# Altium schematic sheet SAMC21N_Xplained_Pro_Target_MCU.SchDoc: Target MCU
size A3; Organization: Microchip India; DocumentNumber: A09-2682; Revision: 4; SheetNumber: 4; SheetTotal: 9; CheckedBy: M.S.K; DrawnBy: Microchip India; PageSetup: Record=PageOptions|CenterHorizontal=True|CenterVertical=True|PrintScale=1.04|XCorrection=1.00|YCorrection=1.00|PrintKind=0|BorderSize=5000000|LeftOffset=0|BottomOffset=0|Orientation=2|PaperLength=4200|PaperWidth=2970|Scale=100|PaperSource=15|PrintQuality=600|MediaType=1|DitherType=10|PrintScaleMode=1|PaperKind=A3|PaperIndex=8; ProjectTitle: ATSAMC21N-XPRO; PCBNumber: A08-2581; PCBRevision: 2
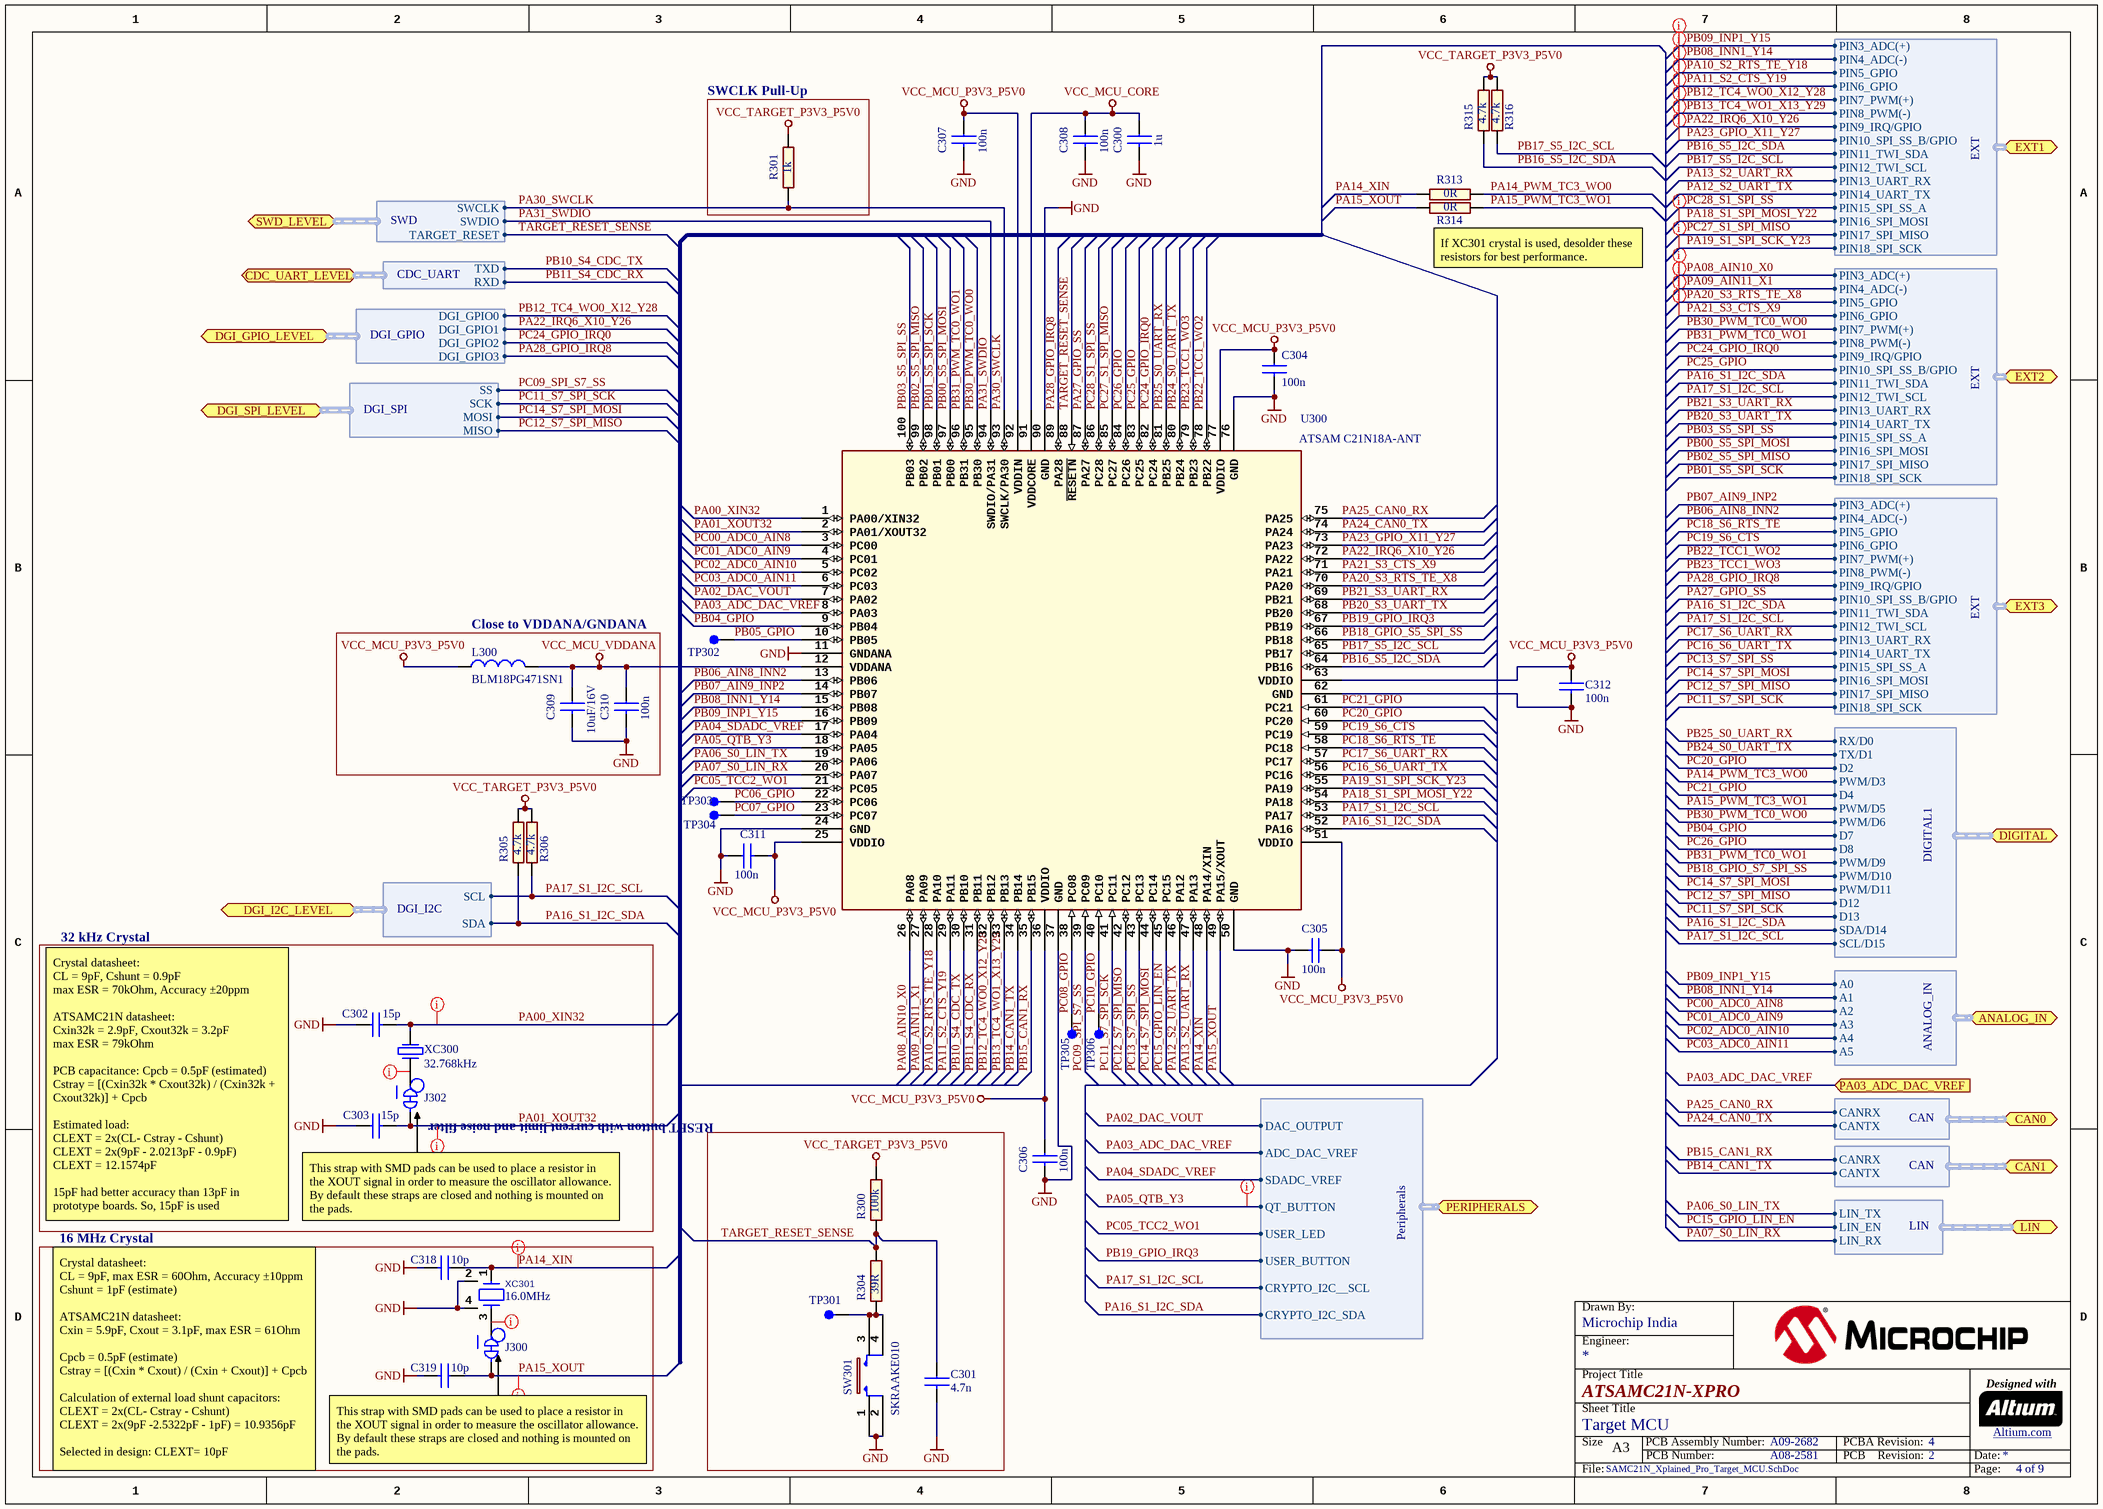
[diagram p0: SAMC21N_Xplained_Pro_Target_MCU.SchDoc]

## Parts
C300  value 1u  [AP1-00001]  (hidden comment: CAP-NONPOL)
C301  value 4.7n  [AP1-00001]  (hidden comment: CAP-NONPOL)
C302  value 15p  [AP1-00001]  (hidden comment: CAP-NONPOL)
C303  value 15p  [AP1-00001]  (hidden comment: CAP-NONPOL)
C304  value 100n  [AP1-00001]  (hidden comment: CAP-NONPOL)
C305  value 100n  [AP1-00001]  (hidden comment: CAP-NONPOL)
C306  value 100n  [AP1-00001]  (hidden comment: CAP-NONPOL)
C307  value 100n  [AP1-00001]  (hidden comment: CAP-NONPOL)
C308  value 100n  [AP1-00001]  (hidden comment: CAP-NONPOL)
C309  value 10uF/16V  [AP1-00039]  (hidden comment: CAP-NONPOL)
C310  value 100n  [AP1-00001]  (hidden comment: CAP-NONPOL)
C311  value 100n  [AP1-00001]  (hidden comment: CAP-NONPOL)
C312  value 100n  [AP1-00001]  (hidden comment: CAP-NONPOL)
C318  value 10p  [AP1-00001]  (hidden comment: CAP-NONPOL)
C319  value 10p  [AP1-00001]  (hidden comment: CAP-NONPOL)
J300  (no value)  [AP9-00044]  (net tie, no BOM)
J302  (no value)  [AP9-00044]  (net tie, no BOM)
L300  BLM18PG471SN1  [AP3-00005]
R300  value 100k  [AP2-00011]  (hidden comment: R2)
R301  value 1k  [AP2-00000]  (hidden comment: R2)
R304  value 39R  [AP2-00011]  (hidden comment: R2)
R305  value 4.7k  [AP2-00000]  (hidden comment: R2)
R306  value 4.7k  [AP2-00000]  (hidden comment: R2)
R313  value 0R  [AP2-00000]  (hidden comment: R2)
R314  value 0R  [AP2-00000]  (hidden comment: R2)
R315  value 4.7k  [AP2-00000]  (hidden comment: R2)
R316  value 4.7k  [AP2-00000]  (hidden comment: R2)
SW301  value SKRAAKE010  [AP8-00137]  (hidden comment: Can be ordered in low volumes from Mouser)
TP301  TESTPOINT  [AP8-00010]  (value not drawn)  (no BOM)
TP302  TESTPOINT  [AP8-00256]  (value not drawn)  (no BOM)
TP303  TESTPOINT  [AP8-00256]  (value not drawn)  (no BOM)
TP304  TESTPOINT  [AP8-00256]  (value not drawn)  (no BOM)
TP305  TESTPOINT  [AP8-00256]  (value not drawn)  (no BOM)
TP306  TESTPOINT  [AP8-00256]  (value not drawn)  (no BOM)
U300  value ATSAM C21N18A-ANT  [AP6-00008]  (hidden comment: SAMC21N_TQFP100)
XC300  value 32.768kHz  [AP7-00090]  (hidden comment: CRYSTAL)
XC301  value 16.0MHz  [AP7-00061]  (hidden comment: TSX-3225)

## Blocks framed on the sheet
SWCLK Pull-Up: R301
Close to VDDANA/GNDANA: C309 C310 L300
32 kHz Crystal: C302 C303 J302 XC300
RESET button with current limit and noise filter: C301 R300 R304 SW301 TP301
16 MHz Crystal: C318 C319 J300 XC301

## Ports
ANALOG_IN (harness ANALOG_IN), CAN0 (harness CAN), CAN1 (harness CAN), CDC_UART_LEVEL (harness CDC_UART), DGI_GPIO_LEVEL (harness DGI_GPIO), DGI_I2C_LEVEL (harness DGI_I2C), DGI_SPI_LEVEL (harness DGI_SPI), DIGITAL (harness DIGITAL1), EXT1 (harness EXT), EXT2 (harness EXT), EXT3 (harness EXT), LIN (harness LIN), PA03_ADC_DAC_VREF (in), PERIPHERALS (harness Peripherals), SWD_LEVEL (harness SWD)

## Harnesses
SWD: SWCLK, SWDIO, TARGET_RESET
DGI_GPIO: DGI_GPIO0, DGI_GPIO1, DGI_GPIO2, DGI_GPIO3
DGI_SPI: MISO, MOSI, SCK, SS
DGI_I2C: SCL, SDA
CDC_UART: RXD, TXD
EXT: PIN10_SPI_SS_B/GPIO, PIN11_TWI_SDA, PIN12_TWI_SCL, PIN13_UART_RX, PIN14_UART_TX, PIN15_SPI_SS_A, PIN16_SPI_MOSI, PIN17_SPI_MISO, PIN18_SPI_SCK, PIN3_ADC(+), PIN4_ADC(-), PIN5_GPIO, PIN6_GPIO, PIN7_PWM(+), PIN8_PWM(-), PIN9_IRQ/GPIO
DIGITAL1: RX/D0, TX/D1, D2, PWM/D3, D4, PWM/D5, PWM/D6, D7, D8, PWM/D9, PWM/D10, PWM/D11, D12, D13, SDA/D14, SCL/D15
ANALOG_IN: A0, A1, A2, A3, A4, A5
CAN: CANTX, CANRX
LIN: LIN_RX, LIN_EN, LIN_TX
Peripherals: DAC_OUTPUT, ADC_DAC_VREF, SDADC_VREF, QT_BUTTON, USER_LED, USER_BUTTON, CRYPTO_I2C__SCL, CRYPTO_I2C_SDA

## Nets
GND: C300.2 C301.2 C302.1 C303.1 C304.2 C305.2 C306.2 C307.2 C308.2 C309.2 C310.2 C311.1 C312.2 C318.2 C319.2 SW301.1 SW301.2 U300.11(GNDANA) U300.24(GND) U300.37(GND) U300.50(GND) U300.62(GND) U300.76(GND) U300.90(GND) XC301.2(GND) XC301.4(GND)
VCC_MCU_CORE: C300.1 C308.1 U300.91(VDDCORE)
VCC_MCU_P3V3_P5V0: C304.1 C305.1 C306.1 C307.1 C311.2 C312.1 L300.1 U300.25(VDDIO) U300.36(VDDIO) U300.51(VDDIO) U300.63(VDDIO) U300.77(VDDIO) U300.92(VDDIN)
VCC_MCU_VDDANA: C309.1 C310.1 L300.2 U300.12(VDDANA)
VCC_TARGET_P3V3_P5V0: R300.2 R301.2 R305.2 R306.2 R315.2 R316.2
PA00_XIN32: C302.2 U300.1(PA00/XIN32) XC300.1
PA01_XOUT32: C303.2 J302.2 U300.2(PA01/XOUT32)
PA02_DAC_VOUT: U300.7(PA02) ; port PERIPHERALS.DAC_OUTPUT
PA03_ADC_DAC_VREF: U300.8(PA03) ; port PA03_ADC_DAC_VREF, port PERIPHERALS.ADC_DAC_VREF
PA04_SDADC_VREF: U300.17(PA04) ; port PERIPHERALS.SDADC_VREF
PA05_QTB_Y3: U300.18(PA05) ; port PERIPHERALS.QT_BUTTON
PA06_S0_LIN_TX: U300.19(PA06) ; port LIN.LIN_TX
PA07_S0_LIN_RX: U300.20(PA07) ; port LIN.LIN_RX
PA08_AIN10_X0: U300.26(PA08) ; port EXT2.PIN3_ADC(+)
PA09_AIN11_X1: U300.27(PA09) ; port EXT2.PIN4_ADC(-)
PA10_S2_RTS_TE_Y18: U300.28(PA10) ; port EXT1.PIN5_GPIO
PA11_S2_CTS_Y19: U300.29(PA11) ; port EXT1.PIN6_GPIO
PA12_S2_UART_TX: U300.46(PA12) ; port EXT1.PIN14_UART_TX
PA13_S2_UART_RX: U300.47(PA13) ; port EXT1.PIN13_UART_RX
PA14_PWM_TC3_WO0: R313.2 ; port DIGITAL.PWM/D3
PA14_XIN: C318.1 R313.1 U300.48(PA14/XIN) XC301.1(IN)
PA15_PWM_TC3_WO1: R314.2 ; port DIGITAL.PWM/D5
PA15_XOUT: C319.1 J300.2 R314.1 U300.49(PA15/XOUT)
PA16_S1_I2C_SDA: R305.1 U300.52(PA16) ; port DGI_I2C_LEVEL.SDA, port EXT2.PIN11_TWI_SDA, port EXT3.PIN11_TWI_SDA, port DIGITAL.SDA/D14, port PERIPHERALS.CRYPTO_I2C_SDA
PA17_S1_I2C_SCL: R306.1 U300.53(PA17) ; port DGI_I2C_LEVEL.SCL, port EXT2.PIN12_TWI_SCL, port EXT3.PIN12_TWI_SCL, port DIGITAL.SCL/D15, port PERIPHERALS.CRYPTO_I2C__SCL
PA18_S1_SPI_MOSI_Y22: U300.54(PA18) ; port EXT1.PIN16_SPI_MOSI
PA19_S1_SPI_SCK_Y23: U300.55(PA19) ; port EXT1.PIN18_SPI_SCK
PA20_S3_RTS_TE_X8: U300.70(PA20) ; port EXT2.PIN5_GPIO
PA21_S3_CTS_X9: U300.71(PA21) ; port EXT2.PIN6_GPIO
PA22_IRQ6_X10_Y26: U300.72(PA22) ; port DGI_GPIO_LEVEL.DGI_GPIO1, port EXT1.PIN9_IRQ/GPIO
PA23_GPIO_X11_Y27: U300.73(PA23) ; port EXT1.PIN10_SPI_SS_B/GPIO
PA24_CAN0_TX: U300.74(PA24) ; port CAN0.CANTX
PA25_CAN0_RX: U300.75(PA25) ; port CAN0.CANRX
PA27_GPIO_SS: U300.87(PA27) ; port EXT3.PIN10_SPI_SS_B/GPIO
PA28_GPIO_IRQ8: U300.89(PA28) ; port DGI_GPIO_LEVEL.DGI_GPIO3, port EXT3.PIN9_IRQ/GPIO
PA30_SWCLK: R301.1 U300.93(SWCLK/PA30) ; port SWD_LEVEL.SWCLK
PA31_SWDIO: U300.94(SWDIO/PA31) ; port SWD_LEVEL.SWDIO
PB00_S5_SPI_MOSI: U300.97(PB00) ; port EXT2.PIN16_SPI_MOSI
PB01_S5_SPI_SCK: U300.98(PB01) ; port EXT2.PIN18_SPI_SCK
PB02_S5_SPI_MISO: U300.99(PB02) ; port EXT2.PIN17_SPI_MISO
PB03_S5_SPI_SS: U300.100(PB03) ; port EXT2.PIN15_SPI_SS_A
PB04_GPIO: U300.9(PB04) ; port DIGITAL.D7
PB05_GPIO: TP302.1 U300.10(PB05)
PB06_AIN8_INN2: U300.13(PB06) ; port EXT3.PIN4_ADC(-)
PB07_AIN9_INP2: U300.14(PB07) ; port EXT3.PIN3_ADC(+)
PB08_INN1_Y14: U300.15(PB08) ; port EXT1.PIN4_ADC(-), port ANALOG_IN.A1
PB09_INP1_Y15: U300.16(PB09) ; port EXT1.PIN3_ADC(+), port ANALOG_IN.A0
PB10_S4_CDC_TX: U300.30(PB10) ; port CDC_UART_LEVEL.TXD
PB11_S4_CDC_RX: U300.31(PB11) ; port CDC_UART_LEVEL.RXD
PB12_TC4_WO0_X12_Y28: U300.32(PB12) ; port DGI_GPIO_LEVEL.DGI_GPIO0, port EXT1.PIN7_PWM(+)
PB13_TC4_WO1_X13_Y29: U300.33(PB13) ; port EXT1.PIN8_PWM(-)
PB14_CAN1_TX: U300.34(PB14) ; port CAN1.CANTX
PB15_CAN1_RX: U300.35(PB15) ; port CAN1.CANRX
PB16_S5_I2C_SDA: R315.1 U300.64(PB16) ; port EXT1.PIN11_TWI_SDA
PB17_S5_I2C_SCL: R316.1 U300.65(PB17) ; port EXT1.PIN12_TWI_SCL
PB18_GPIO_S5_SPI_SS: U300.66(PB18)
PB18_GPIO_S7_SPI_SS: port DIGITAL.PWM/D10
PB19_GPIO_IRQ3: U300.67(PB19) ; port PERIPHERALS.USER_BUTTON
PB20_S3_UART_TX: U300.68(PB20) ; port EXT2.PIN14_UART_TX
PB21_S3_UART_RX: U300.69(PB21) ; port EXT2.PIN13_UART_RX
PB22_TCC1_WO2: U300.78(PB22) ; port EXT3.PIN7_PWM(+)
PB23_TCC1_WO3: U300.79(PB23) ; port EXT3.PIN8_PWM(-)
PB24_S0_UART_TX: U300.80(PB24) ; port DIGITAL.TX/D1
PB25_S0_UART_RX: U300.81(PB25) ; port DIGITAL.RX/D0
PB30_PWM_TC0_WO0: U300.95(PB30) ; port EXT2.PIN7_PWM(+), port DIGITAL.PWM/D6
PB31_PWM_TC0_WO1: U300.96(PB31) ; port EXT2.PIN8_PWM(-), port DIGITAL.PWM/D9
PC00_ADC0_AIN8: U300.3(PC00) ; port ANALOG_IN.A2
PC01_ADC0_AIN9: U300.4(PC01) ; port ANALOG_IN.A3
PC02_ADC0_AIN10: U300.5(PC02) ; port ANALOG_IN.A4
PC03_ADC0_AIN11: U300.6(PC03) ; port ANALOG_IN.A5
PC05_TCC2_WO1: U300.21(PC05) ; port PERIPHERALS.USER_LED
PC06_GPIO: TP303.1 U300.22(PC06)
PC07_GPIO: TP304.1 U300.23(PC07)
PC08_GPIO: TP305.1 U300.38(PC08)
PC09_SPI_S7_SS: U300.39(PC09) ; port DGI_SPI_LEVEL.SS
PC10_GPIO: TP306.1 U300.40(PC10)
PC11_S7_SPI_SCK: U300.41(PC11) ; port DGI_SPI_LEVEL.SCK, port EXT3.PIN18_SPI_SCK, port DIGITAL.D13
PC12_S7_SPI_MISO: U300.42(PC12) ; port DGI_SPI_LEVEL.MISO, port EXT3.PIN17_SPI_MISO, port DIGITAL.D12
PC13_S7_SPI_SS: U300.43(PC13) ; port EXT3.PIN15_SPI_SS_A
PC14_S7_SPI_MOSI: U300.44(PC14) ; port DGI_SPI_LEVEL.MOSI, port EXT3.PIN16_SPI_MOSI, port DIGITAL.PWM/D11
PC15_GPIO_LIN_EN: U300.45(PC15) ; port LIN.LIN_EN
PC16_S6_UART_TX: U300.56(PC16) ; port EXT3.PIN14_UART_TX
PC17_S6_UART_RX: U300.57(PC17) ; port EXT3.PIN13_UART_RX
PC18_S6_RTS_TE: U300.58(PC18) ; port EXT3.PIN5_GPIO
PC19_S6_CTS: U300.59(PC19) ; port EXT3.PIN6_GPIO
PC20_GPIO: U300.60(PC20) ; port DIGITAL.D2
PC21_GPIO: U300.61(PC21) ; port DIGITAL.D4
PC24_GPIO_IRQ0: U300.82(PC24) ; port DGI_GPIO_LEVEL.DGI_GPIO2, port EXT2.PIN9_IRQ/GPIO
PC25_GPIO: U300.83(PC25) ; port EXT2.PIN10_SPI_SS_B/GPIO
PC26_GPIO: U300.84(PC26) ; port DIGITAL.D8
PC27_S1_SPI_MISO: U300.85(PC27) ; port EXT1.PIN17_SPI_MISO
PC28_S1_SPI_SS: U300.86(PC28) ; port EXT1.PIN15_SPI_SS_A
TARGET_RESET_SENSE: C301.1 R300.1 R304.2 U300.88(~{RESETN}) ; port SWD_LEVEL.TARGET_RESET
NetJ300_1: J300.1 XC301.3(OUT)
NetJ302_1: J302.1 XC300.2
NetR304_1: R304.1 SW301.3 SW301.4 TP301.1

## Layout directives
rule Assembly Testpoint Usage [Testpoint - Not Allowed    Multiple - Not Allowed]: NetJ300_1, NetJ302_1, PA00_XIN32, PA01_XOUT32, PA14_XIN, PA15_XOUT
net class TOUCH; rule Clearance Constraint [Clearance = 0.6mm]: PA05_QTB_Y3, PA08_AIN10_X0, PA09_AIN11_X1, PA10_S2_RTS_TE_Y18, PA11_S2_CTS_Y19, PA18_S1_SPI_MOSI_Y22, PA19_S1_SPI_SCK_Y23, PA20_S3_RTS_TE_X8, PA21_S3_CTS_X9, PA22_IRQ6_X10_Y26, PA23_GPIO_X11_Y27, PB08_INN1_Y14, PB09_INP1_Y15, PB12_TC4_WO0_X12_Y28, PB13_TC4_WO1_X13_Y29

## Notes on the sheet
- If XC301 crystal is used, desolder these resistors for best performance.
- Crystal datasheet:
  CL = 9pF, Cshunt = 0.9pF
  max ESR = 70kOhm, Accuracy ±20ppm
  ATSAMC21N datasheet:
  Cxin32k = 2.9pF, Cxout32k = 3.2pF
  max ESR = 79kOhm
  PCB capacitance: Cpcb = 0.5pF (estimated)
  Cstray = [(Cxin32k * Cxout32k) / (Cxin32k + Cxout32k)] + Cpcb
  Estimated load:
  CLEXT = 2x(CL- Cstray - Cshunt)
  CLEXT = 2x(9pF - 2.0213pF - 0.9pF)
  CLEXT = 12.1574pF
  15pF had better accuracy than 13pF in prototype boards. So, 15pF is used
- This strap with SMD pads can be used to place a resistor in the XOUT signal in order to measure the oscillator allowance.
  By default these straps are closed and nothing is mounted on the pads.
- Crystal datasheet:
  CL = 9pF, max ESR = 60Ohm, Accuracy ±10ppm
  Cshunt = 1pF (estimate)
  ATSAMC21N datasheet:
  Cxin = 5.9pF, Cxout = 3.1pF, max ESR = 61Ohm
  Cpcb = 0.5pF (estimate)
  Cstray = [(Cxin * Cxout) / (Cxin + Cxout)] + Cpcb
  Calculation of external load shunt capacitors:
  CLEXT = 2x(CL- Cstray - Cshunt)
  CLEXT = 2x(9pF -2.5322pF - 1pF) = 10.9356pF
  Selected in design: CLEXT= 10pF
- Drawn By:
- Project Title
- Engineer:
- Designed with
- Sheet Title
- Size
- A3
- PCB Number:
- PCB Assembly Number:
- PCBA Revision:
- PCB    Revision:
- Date:
- Altium.com <http://go.altium.com/MicrochipLandingPage_Evaluation.html>
- File:
- Page:

## Library data of the parts
C300 = A01-0286: Ceramic capacitor, SMD 0402, X5R, 6.3V, +/-10% (de26942); PartGroup: Capacitors,Ceramic,SMD 0402; Manufacturer: Kemet; MPN: C0402C105K9PAC; TemperatureRange: -55 to 85 deg C; ComponentStatus: 'Active (verified)'; Status: Active; Verified by: Lars Helge Mo; Verified date: 2005-12-15; AN: A01-0286; Tolerance: +/-10%; Height: 0,5; FootprintStatus: 'Active (Verified)'
C301 = A01-0046: Ceramic capacitor, SMD 0402, X7R, 25V, +/-10% (de35287); PartGroup: Capacitors,Ceramic,SMD 0402; TemperatureRange: -55 - +125 deg C; ComponentStatus: 'Active (verified)'; Status: Active; Verified by: Lars Helge Mo; Verified date: 2005-12-15; AN: A01-0046; Tolerance: 25V, +/-10%; Height: 0.550000011920929; FootprintStatus: 'Active (Verified)'
C302 C303 = A01-0017: Ceramic capacitor, SMD 0402, NP0, 50V, +/-5%; PartGroup: Capacitors,Ceramic,SMD 0402; Manufacturer: AVX; MPN: 04025A150JAT2A; TemperatureRange: -55 - +125 deg C; ComponentStatus: 'Active (verified)'; Status: Active; Verified by: Lars Helge Mo; Verified date: 2005-12-15; AN: A01-0017; Tolerance: 50V, +/-5%; Height: 0.550000011920929; FootprintStatus: 'Active (Verified)'
C304-C308 C310-C312 = A01-0246: Ceramic capacitor, SMD 0402, X7R, 16V, +/-10%; PartGroup: Capacitors,Ceramic,SMD 0402; Manufacturer: Kemet; MPN: C0402C104K4RACTU; TemperatureRange: -55 - +125 deg C; ComponentStatus: 'Active (verified)'; Status: Active; Verified by: Lars Helge Mo; Verified date: 2005-12-15; AN: A01-0246; Tolerance: 16V, +/-10%; Height: 0,5; FootprintStatus: 'Active (Verified)'
C309 = A01-0491: Ceramic capacitor, SMD 0603, X5R, 16V, 10UF ± 20% (High Density); PartGroup: Capacitors,Ceramic,SMD 0603; Manufacturer: Taiyo Yuden; MPN: EMK107BBJ106MA-T; ComponentStatus: 'New (not verified)'; Status: Active; Verified by: Lars Helge Mo; Verified date: 2005-12-15; AN: A01-0491; FootprintStatus: 'Active (Verified)'
C318 C319 = A01-0015: Ceramic capacitor, SMD 0402, NP0, 50V, +/-5%; PartGroup: Capacitors,Ceramic,SMD 0402; TemperatureRange: -55 - +125 deg C; ComponentStatus: 'Active (verified)'; Status: Active; Verified by: Lars Helge Mo; Verified date: 2005-12-15; AN: A01-0015; Tolerance: 50V, +/-5%; Height: 0,550000011920929; FootprintStatus: 'Active (Verified)'
J300 J302 = A09-0783: Default closed SMD strap, 0603 size; PartGroup: Mechanical devices,PCB implemented components; Value: SMD-STRAP_0603_CLOSED; ComponentStatus: 'Active (verified)'; AN: A09-0783; Height: 0; FootprintStatus: 'Active (Verified)'
L300 = A03-0035: SMD RF inductor 0603. Z=470Ohm (@100MHz), Max R(dc)=0.65Ohm, Max current=1A; PartGroup: Inductors,EMI; Manufacturer: Murata; Tolerance: ±25%; TemperatureRange: -55°C to +125°C; ComponentStatus: 'Active (verified)'; Verified date: 2006-01-30; Verified by: Lars Helge Mo; Status: Active; AN: A03-0035; Value: BLM18PG471SN1; Height: 0,800000011920929; MPN: BLM18PG471SN1; FootprintStatus: 'Active (Verified)'
R300 = A02-0260: Thick film resistor, SMD 0402, 1/16W, 1%; PartGroup: Resistors,SMD,0402 1%; TemperatureRange: -55 - +125 deg C; ComponentStatus: 'Active (verified)'; Status: Active; Verified by: Lars Helge Mo; Verified date: 2005-12-19; AN: A02-0260; Tolerance: 1 %; Height: 0,349999994039536; FootprintStatus: 'Active (Verified)'
R301 = A02-0212: Thick film resistor, SMD 0402, 1/16W, 1%; PartGroup: Resistors,SMD,0402 1%; TemperatureRange: -55 - +125 deg C; ComponentStatus: 'Active (verified)'; Status: Active; Verified by: Lars Helge Mo; Verified date: 2005-12-19; AN: A02-0212; Tolerance: 1 %; Height: 0,349999994039536; FootprintStatus: 'Active (Verified)'
R304 = A02-0178: Thick film resistor, SMD 0402, 1/16W, 1%; PartGroup: Resistors,SMD,0402 1%; TemperatureRange: -55 - +125 deg C; ComponentStatus: 'Active (verified)'; Status: Active; Verified by: Lars Helge Mo; Verified date: 2005-12-19; AN: A02-0178; Tolerance: 1 %; Height: 0,349999994039536; FootprintStatus: 'Active (Verified)'
R305 R306 R315 R316 = A02-0228: Thick film resistor, SMD 0402, 1/16W, 1%; PartGroup: Resistors,SMD,0402 1%; TemperatureRange: -55 - +125 deg C; ComponentStatus: 'Active (verified)'; Status: Active; Verified by: Lars Helge Mo; Verified date: 2005-12-19; AN: A02-0228; Tolerance: 1 %; Height: 0.349999994039536; FootprintStatus: 'Active (Verified)'
R313 R314 = A02-0163: Thick film resistor, SMD 0402, 1/16W, 1%; PartGroup: Resistors,SMD,0402 1%; TemperatureRange: -55 - +125 deg C; ComponentStatus: 'Active (verified)'; Status: Active; Verified by: Lars Helge Mo; Verified date: 2005-12-19; AN: A02-0163; Tolerance: 1 %; Height: 0.349999994039536; FootprintStatus: 'Active (Verified)'
SW301 = A08-0790: 6.2x6.2 mm SMD tact switch, same as A08-0091 but less force is needed; PartGroup: Mechanical devices,Switches,SMD; Manufacturer: ALPS; TemperatureRange: -30 - +90 deg C; ComponentStatus: 'Active (verified)'; Status: Active; Verified by: Ketil Skjerve; Verified date: 2006-03-15; AN: A08-0790; Height: 5,09999990463257; MPN: SKRAAKE010; FootprintStatus: 'Active (Verified)'
TP301 = A08-0004: Single SMD testpad; PartGroup: Mechanical devices,Connectors,Test points; ComponentStatus: 'Active (verified)'; Status: Active; Verified by: Sveinung Helgeland; Verified date: 2006-02-17; AN: A08-0004; Value: TESTPAD; Height: 0; FootprintStatus: 'Active (Verified)'
TP302-TP306 = A09-0290: Hole for user grid with 1.27 mm pitch, 1x1 mm pad; PartGroup: Mechanical devices,PCB implemented components,PCB Screw Hole components; Value: Hole 0.65 mm; ComponentStatus: 'Active (verified)'; Status: Active; Verified by: Sveinung Helgeland; Verified date: 2006-02-17; AN: A09-0290; FootprintStatus: 'Active (Verified)'
U300 = A06-1392: Atmel 32-bit ARM Cortex-M0+ processor 100pin 256KB Flash 32KB SRAM 48MHz freq; PartGroup: Integrated Circuits,MCU, MPU, DSP,ARM MCU; ComponentStatus: 'Active (verified)'; AN: A06-1392; Height: 1.60000002384186; Manufacturer: ATMEL; MPN: ATSAM C21N18A-ANT; FootprintStatus: 'Active (Verified)'
XC300 = A07-0129: Kyocera ST3215SB32768E0HPWBB, 32.768kHz, 9pF, SMD tuning fork crystal; PartGroup: Frequency devices,Crystals,SMD; Manufacturer: Kyocera Crystal Device Corporation; Tolerance: Â±20ppm; TemperatureRange: -40Â°C to +85Â°C; ComponentStatus: 'Active (verified)'; Status: Active; Verified by: Sveinung Helgeland; Verified date: 2006-02-17; AN: A07-0129; Height: 0.800000011920929; MPN: ST3215SB32768E0HPWBB; FootprintStatus: 'Active (Verified)'
XC301 = A07-0078: 16MHz uXtal, 3.2 x 2.5 mm SMD, CL=9pF, 15PPM, ESR=80ohm(Max.; PartGroup: Frequency devices,Crystals,SMD; Manufacturer: Epson Toyocom; MPN: TSX-3225 16.0000MF09Z-AC3; TemperatureRange: -40Â°C to +85Â°C; ComponentStatus: 'Active (verified)'; AN: A07-0078; Tolerance: 15ppm; Height: 0.699999988079071; FootprintStatus: 'Active (Verified)'